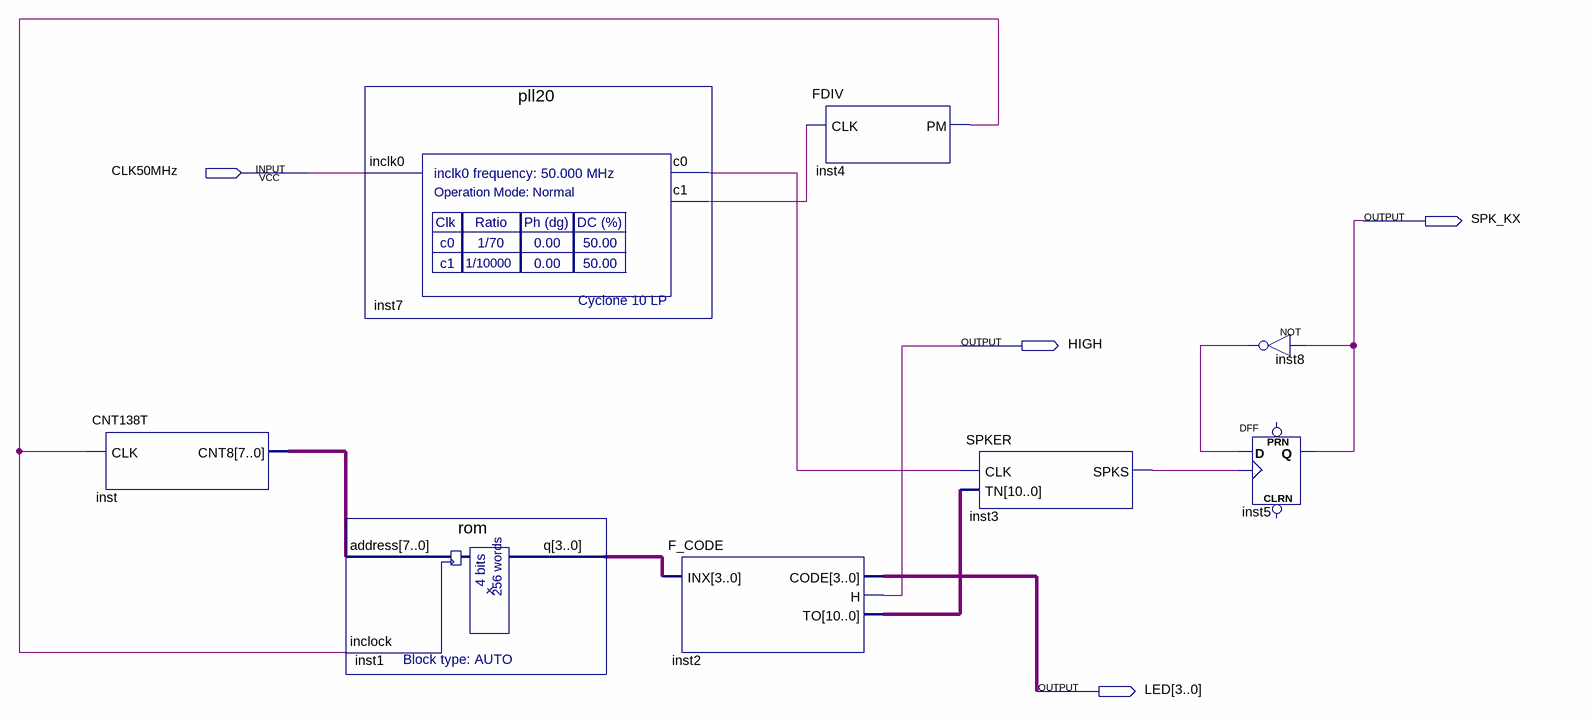
[diagram p0: schematic sheet]
// Quartus schematic music.bdf as structural Verilog: 8 symbols, 4 pins
module music (
  input  CLK50MHz,
  output SPK_KX,
  output HIGH,
  output [3:0] LED
);

  wire inst3_spks, inst4_pm, inst7_c0, inst7_c1, inst8_out;
  wire [3:0] inst1_q;
  wire [7:0] inst_cnt8;
  wire [10:0] inst2_to;

  CNT138T inst (.CLK(inst4_pm), .CNT8(inst_cnt8));
  pll20 inst7 (.inclk0(CLK50MHz), .c0(inst7_c0), .c1(inst7_c1));
  rom inst1 (.address(inst_cnt8), .inclock(inst4_pm), .q(inst1_q));
  F_CODE inst2 (.INX(inst1_q), .CODE(LED), .H(HIGH), .TO(inst2_to));
  FDIV inst4 (.CLK(inst7_c1), .PM(inst4_pm));
  SPKER inst3 (.CLK(inst7_c0), .TN(inst2_to), .SPKS(inst3_spks));
  not inst8 (inst8_out, SPK_KX);
  DFF inst5 (.CLK(inst3_spks), .D(inst8_out), .Q(SPK_KX));  // open: CLRN, PRN
endmodule
